# EasyEDA Pro project OSC1.eprj, board 编码器
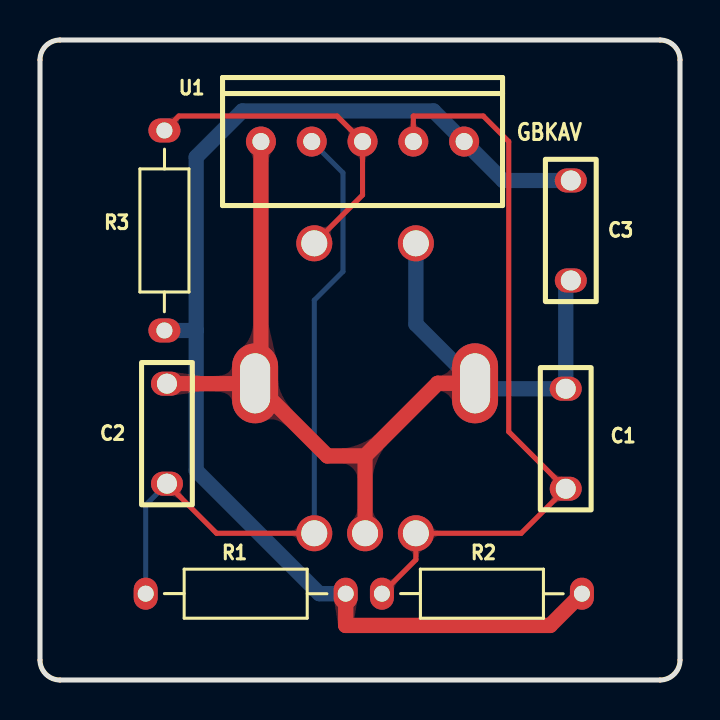
[diagram p15: board, top side]
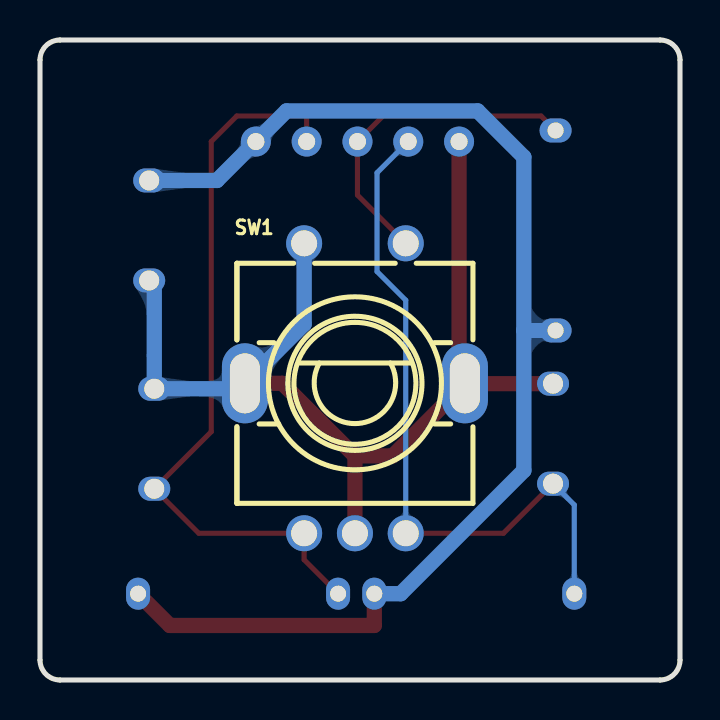
[diagram p16: board, bottom side, seen from below]

Outline 32 x 32 mm; copper layers: Top Layer, Bottom Layer. Coordinates in mm from the lower left corner of the outline.
Outline path: 0,31 0,1 arc(0.29,0.29) 1,0 31,0 arc(31.71,0.29) 32,1 32,31 arc(31.71,31.71) 31,32 1,32 arc(0.29,31.71) 0,31
Stack: Top Layer 0.035mm / Dielectric1 1.51mm FR4 er 4.5 / Bottom Layer 0.035mm

## Design rules (mm)
template: 自定义配置
spacing copperThickness1oz (default): track to track 0.203, other pairs 0.203 to 0.203
spacing copperThickness2oz: track to track 0.203, other pairs 0.152 to 0.3
track width copperThickness1oz (default): min 0.254, default 0.254, max 2.54
track width copperThickness2oz: min 0.203, default 0.254, max 2.54
track width VCC: min 0.762, default 0.762, max 2.54
differential pair differentialPair (default): width min 0.127, default 0.254, max 2.54; gap min 0.152, default 0.152
via viaSize (default): diameter min 0.5, default 0.61, max 10; hole min 0.3, default 0.305, max 6.299
net GND uses VCC
net VCC uses VCC

## Placement (name value [footprint] x y rotation side)
C1  104  [280*100mil]  26.29 12.06 270 top
C2  104  [280*100mil]  6.35 12.32 270 top
C3  104  [280*100mil]  26.54 22.48 90 top
R1  10K  [240*80mil]  10.28 4.32 0 top
R2  10K  [240*80mil]  22.1 4.32 0 top
R3  10K  [240*80mil]  6.22 22.48 270 top
SW1  -  [旋转编码器]  16.25 14.86 180 bottom
U1  -  [CH2.54-5插座]  16.13 26.92 0 top

## Footprints (pads in the part's own frame, mm; a bottom-side part is the same pattern mirrored in y, then rotated)
240*80mil
  oval 1.2x1.6 hole 0.8: 1(-5,0) 2(5,0)
280*100mil
  oval 1.2x1.6 hole 1x0.8: 1(-2.5,0) 2(2.5,0)
CH2.54-5插座
  round 1.5 hole 0.85: 1(-5.08,0) 2(-2.54,0) 3(0,0) 4(2.54,0) 5(5.08,0)
旋转编码器
  oval 2.301x4 hole 1.501x2.999: 6(5.499,-0.023) 7(-5.499,-0.023)
  round 1.801 hole 1.3: A(-2.54,-7.521) B(2.54,-7.521) C(0,-7.521) D(-2.54,6.977) E(2.54,6.977)

## Nets
As in the schematic.

## Routing (per net, layer and track width the routed paths; a pad name or vN(x,y) marks a point on that pad's centre or on a via; arc(x,y) is an arc through that point)
GND: length 52.9
  Top Layer w0.762: SW1.7 19.88,14.83 16.25,11.2 ; U1.1 11.05,15.11 10.75,14.82 ; 10.75,14.82 SW1.6 ; 10.75,14.82 14.37,11.2 16.25,11.2 ; 10.75,14.82 C2.1 ; 16.25,11.2 SW1.C
  Bottom Layer w0.762: C3.1 26.29,19.72 C1.1 22.02,14.56 SW1.7 18.79,17.79 SW1.D
VCC: length 62.5
  Top Layer w0.762: R1.2 15.28,2.73 25.51,2.73 R2.2
  Bottom Layer w0.762: 7.81,17.48 7.81,26.15 10.12,28.45 19.68,28.45 U1.5 23.15,24.98 C3.2 ; 7.81,17.48 7.81,10.47 13.97,4.32 R1.2 ; 7.81,17.48 R3.2
KEY: length 16.8
  Top Layer w0.254: SW1.E 16.13,24.25 U1.3 14.85,28.2 6.94,28.2 R3.1
$1N521: length 37.3
  Top Layer w0.254: R2.1 18.79,6.01 SW1.A 24.06,7.34 C1.2 23.44,12.41 23.44,26.92 22.16,28.2 18.67,28.2 U1.4
$1N637: length 35.2
  Top Layer w0.254: C2.2 8.83,7.34 SW1.B
  Bottom Layer w0.254: SW1.B 13.71,18.99 15.15,20.42 15.15,25.36 U1.2 ; C2.2 5.28,8.75 R1.1

## Copper pours and planes (outline as drawn; the poured copper is in the pictures)
GND on Top Layer: -3.56,34.54 35.69,34.54 35.69,-2.03 -3.56,-2.03
GND on Bottom Layer: -3.56,34.54 35.69,34.54 35.69,-2.03 -3.56,-2.03

Small or netless copper shapes (teardrops, artwork), in the pictures only: 23 on Top Layer, 16 on Bottom Layer

## Text on the board
Top Silkscreen Layer: GBKAV
